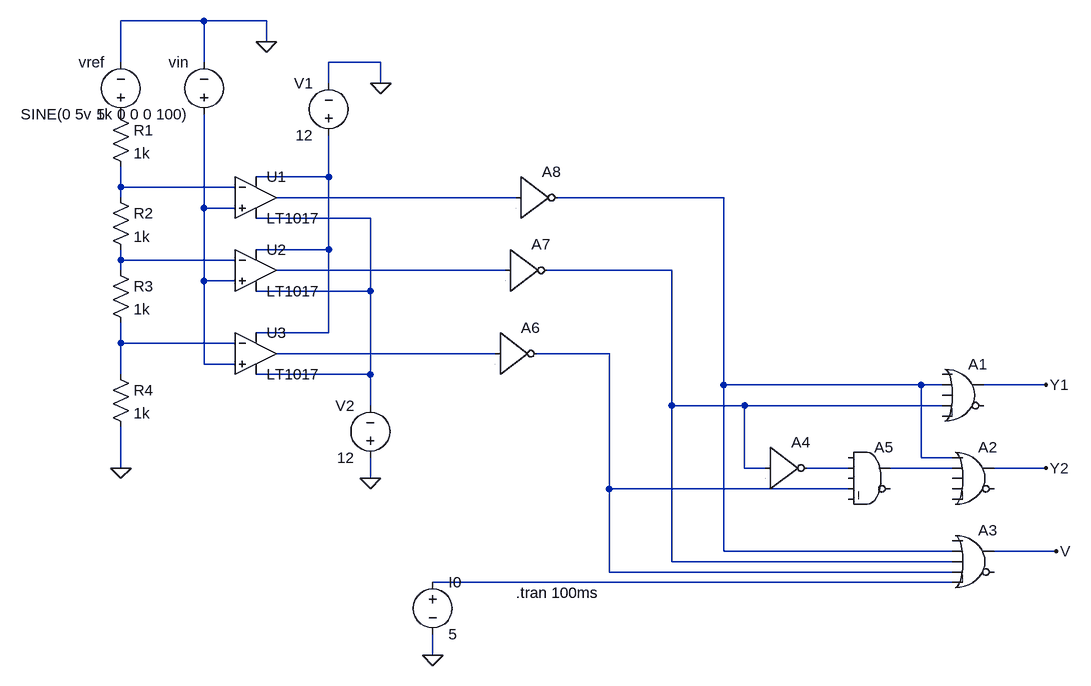
[diagram p0: schematic adc_4_to_2.asc]
adc_4_to_2.asc, the LTspice schematic file:
Version 4
SHEET 1 880 916
WIRE -944 -80 -1072 -80
WIRE -848 -80 -944 -80
WIRE -848 -48 -848 -80
WIRE -1072 -16 -1072 -80
WIRE -944 -16 -944 -80
WIRE -672 -16 -752 -16
WIRE -752 16 -752 -16
WIRE -672 16 -672 -16
WIRE -752 160 -752 96
WIRE -752 160 -864 160
WIRE -1072 176 -1072 144
WIRE -896 176 -1072 176
WIRE -1072 192 -1072 176
WIRE -464 192 -832 192
WIRE -144 192 -400 192
WIRE -944 208 -944 64
WIRE -896 208 -944 208
WIRE -688 224 -864 224
WIRE -752 272 -752 160
WIRE -752 272 -864 272
WIRE -1072 288 -1072 272
WIRE -896 288 -1072 288
WIRE -1072 304 -1072 288
WIRE -480 304 -832 304
WIRE -224 304 -416 304
WIRE -944 320 -944 208
WIRE -896 320 -944 320
WIRE -688 336 -688 224
WIRE -688 336 -864 336
WIRE -752 400 -752 272
WIRE -752 400 -864 400
WIRE -1072 416 -1072 384
WIRE -896 416 -1072 416
WIRE -496 432 -832 432
WIRE -320 432 -432 432
WIRE -944 448 -944 320
WIRE -896 448 -944 448
WIRE -1072 464 -1072 416
WIRE -688 464 -688 336
WIRE -688 464 -864 464
WIRE -144 480 -144 192
WIRE 160 480 -144 480
WIRE 192 480 160 480
WIRE 352 480 256 480
WIRE -688 512 -688 464
WIRE -224 512 -224 304
WIRE -112 512 -224 512
WIRE 192 512 -112 512
WIRE 160 592 160 480
WIRE 208 592 160 592
WIRE -1072 608 -1072 544
WIRE -112 608 -112 512
WIRE -80 608 -112 608
WIRE 48 608 -16 608
WIRE 208 608 112 608
WIRE 352 608 272 608
WIRE -688 624 -688 592
WIRE -320 640 -320 432
WIRE 48 640 -320 640
WIRE -144 736 -144 480
WIRE 208 736 -144 736
WIRE 368 736 272 736
WIRE -224 752 -224 512
WIRE 208 752 -224 752
WIRE -320 768 -320 640
WIRE 208 768 -320 768
WIRE 208 784 -592 784
WIRE -592 896 -592 864
FLAG 352 480 Y1
FLAG 352 608 Y2
FLAG 368 736 V
FLAG -1072 608 0
FLAG -848 -48 0
FLAG -688 624 0
FLAG -672 16 0
FLAG -592 896 0
SYMBOL Digital\\inv -80 544 R0
SYMATTR InstName A4
SYMBOL Digital\\or 224 432 R0
SYMATTR InstName A1
SYMBOL Digital\\or 240 560 R0
SYMATTR InstName A2
SYMBOL Digital\\or 240 688 R0
SYMATTR InstName A3
SYMBOL Digital\\and 80 560 R0
SYMATTR InstName A5
SYMBOL res -1088 48 R0
SYMATTR InstName R1
SYMATTR Value 1k
SYMBOL res -1088 176 R0
SYMATTR InstName R2
SYMATTR Value 1k
SYMBOL res -1088 288 R0
SYMATTR InstName R3
SYMATTR Value 1k
SYMBOL Comparators\\LT1017 -864 192 R0
SYMATTR InstName U1
SYMBOL Comparators\\LT1017 -864 304 R0
SYMATTR InstName U2
SYMBOL Comparators\\LT1017 -864 432 R0
SYMATTR InstName U3
SYMBOL voltage -944 80 R180
WINDOW 0 24 96 Left 2
WINDOW 3 24 16 Left 2
WINDOW 123 0 0 Left 0
WINDOW 39 0 0 Left 0
SYMATTR InstName vin
SYMATTR Value SINE(0 5v 1k 0 0 0 100)
SYMBOL voltage -1072 80 R180
WINDOW 0 24 96 Left 2
WINDOW 3 24 16 Left 2
WINDOW 123 0 0 Left 0
WINDOW 39 0 0 Left 0
SYMATTR InstName vref
SYMATTR Value 5
SYMBOL res -1088 448 R0
SYMATTR InstName R4
SYMATTR Value 1k
SYMBOL voltage -752 112 R180
WINDOW 0 24 96 Left 2
WINDOW 3 24 16 Left 2
WINDOW 123 0 0 Left 0
WINDOW 39 0 0 Left 0
SYMATTR InstName V1
SYMATTR Value 12
SYMBOL voltage -688 608 R180
WINDOW 0 24 96 Left 2
WINDOW 3 24 16 Left 2
WINDOW 123 0 0 Left 0
WINDOW 39 0 0 Left 0
SYMATTR InstName V2
SYMATTR Value 12
SYMBOL voltage -592 768 R0
WINDOW 123 0 0 Left 0
WINDOW 39 0 0 Left 0
SYMATTR InstName I0
SYMATTR Value 5
SYMBOL Digital\\inv -496 368 R0
SYMATTR InstName A6
SYMBOL Digital\\inv -480 240 R0
SYMATTR InstName A7
SYMBOL Digital\\inv -464 128 R0
SYMATTR InstName A8
TEXT -464 800 Left 2 !.tran 100ms

The netlist it stands for:
* adc_4_to_2.asc
A4 N009 0 0 0 0 N013 0 0 BUF
A1 0 N004 0 N009 0 0 Y1 0 OR
A2 N004 N014 0 0 0 0 Y2 0 OR
A3 0 N004 N009 N012 N015 0 V 0 OR
A5 0 N013 0 N012 0 0 N014 0 AND
R1 P001 N002 1k
R2 N002 N007 1k
R3 N007 N010 1k
XU1 N005 N002 N001 N006 N003 LT1017  ; pins In+ In- V+ V- OUT
XU2 N005 N007 N001 N006 N008 LT1017  ; pins In+ In- V+ V- OUT
XU3 N005 N010 N001 N006 N011 LT1017  ; pins In+ In- V+ V- OUT
vin N005 0 SINE(0 5v 1k 0 0 0 100)
vref P001 0 5
R4 N010 0 1k
V1 N001 0 12
V2 0 N006 12
V§I0 N015 0 5
A6 N011 0 0 0 0 N012 0 0 BUF
A7 N008 0 0 0 0 N009 0 0 BUF
A8 N003 0 0 0 0 N004 0 0 BUF
.tran 100ms
.backanno
.end